# EAGLE design RN4020_Breakout (EAGLE 8.2.2)
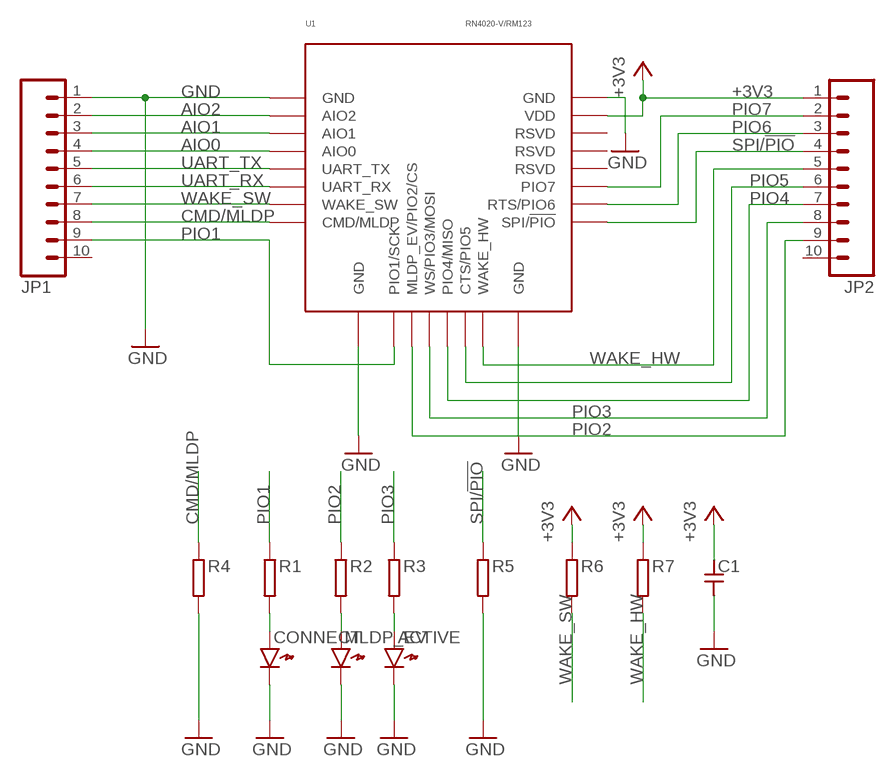
[diagram p0: schematic, sheet 1]

## Parts
ACTIVE  LED1608_REDUCED  [LED1608_REDUCED]
C1  CAPACITOR1608_REDUCED  [SMD1608_REDUCED]
CONNECT  LED1608_REDUCED  [LED1608_REDUCED]
JP1  M10NOSILK  [1X10-NOSILK]
JP2  M10NOSILK  [1X10-NOSILK]
MLDP_EV  LED1608_REDUCED  [LED1608_REDUCED]
R1  RESISTOR1608_REDUCED  [SMD1608_REDUCED]
R2  RESISTOR1608_REDUCED  [SMD1608_REDUCED]
R3  RESISTOR1608_REDUCED  [SMD1608_REDUCED]
R4  RESISTOR1608_REDUCED  [SMD1608_REDUCED]
R5  RESISTOR1608_REDUCED  [SMD1608_REDUCED]
R6  RESISTOR1608_REDUCED  [SMD1608_REDUCED]
R7  RESISTOR1608_REDUCED  [SMD1608_REDUCED]
U1  RN4020-V/RM123  [RN4020]

## Nets
+3V3: C1.1 JP2.1 R6.1 R7.1 U1.23(VDD)
AIO0: JP1.4 U1.4(AIO0)
AIO1: JP1.3 U1.3(AIO1)
AIO2: JP1.2 U1.2(AIO2)
CMD/MLDP: JP1.8 R4.1 U1.8(CMD/MLDP)
GND: ACTIVE.K C1.2 CONNECT.K JP1.1 MLDP_EV.K R4.2 R5.2 U1.1(GND) U1.9(GND) U1.16(GND) U1.24(GND)
N$5: CONNECT.A R1.2
N$6: MLDP_EV.A R2.2
N$7: ACTIVE.A R3.2
PIO1: JP1.9 R1.1 U1.10(PIO1/SCK)
PIO2: JP2.9 R2.1 U1.11(MLDP_EV/PIO2/CS)
PIO3: JP2.8 R3.1 U1.12(WS/PIO3/MOSI)
PIO4: JP2.7 U1.13(PIO4/MISO)
PIO5: JP2.6 U1.14(CTS/PIO5)
PIO6: JP2.3 U1.18(RTS/PIO6)
PIO7: JP2.2 U1.19(PIO7)
SPI/!PIO: JP2.4 R5.1 U1.17(SPI/!PIO)
UART_RX: JP1.6 U1.6(UART_RX)
UART_TX: JP1.5 U1.5(UART_TX)
WAKE_HW: JP2.5 R7.2 U1.15(WAKE_HW)
WAKE_SW: JP1.7 R6.2 U1.7(WAKE_SW)
Unconnected: JP1.10 JP2.10 U1.20(RSVD) U1.21(RSVD) U1.22(RSVD)

## Library data of the parts
ACTIVE CONNECT MLDP_EV = generic:LED: Generic LEDs
C1 = generic:CAPACITOR: Generic Capacitor
JP1 JP2 = header:M10
R1-R7 = generic:RESISTOR: Generic Registor
U1 = com_module:RN4020: Bluetooth Low Energy Module Microchip

## Board
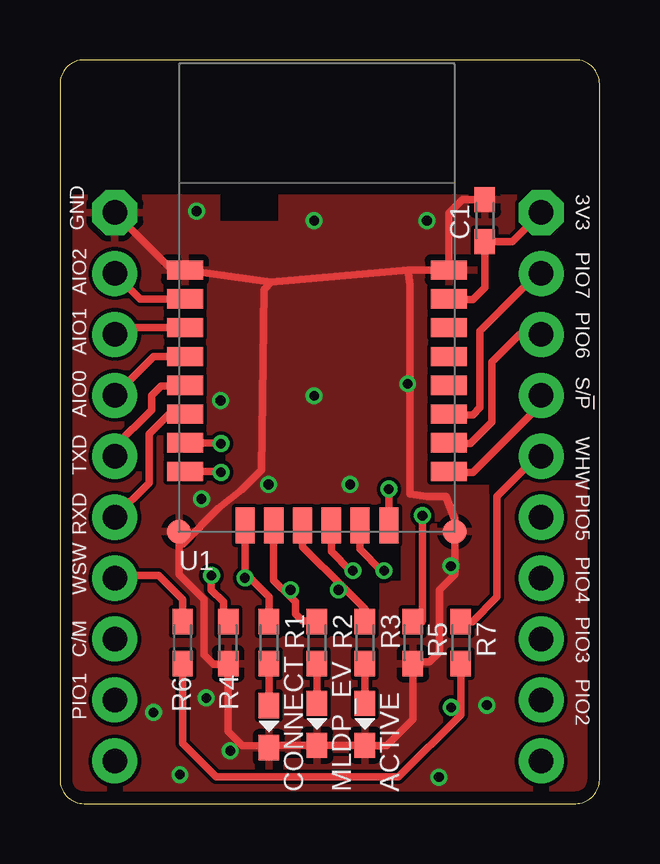
[diagram p1: board, top side]
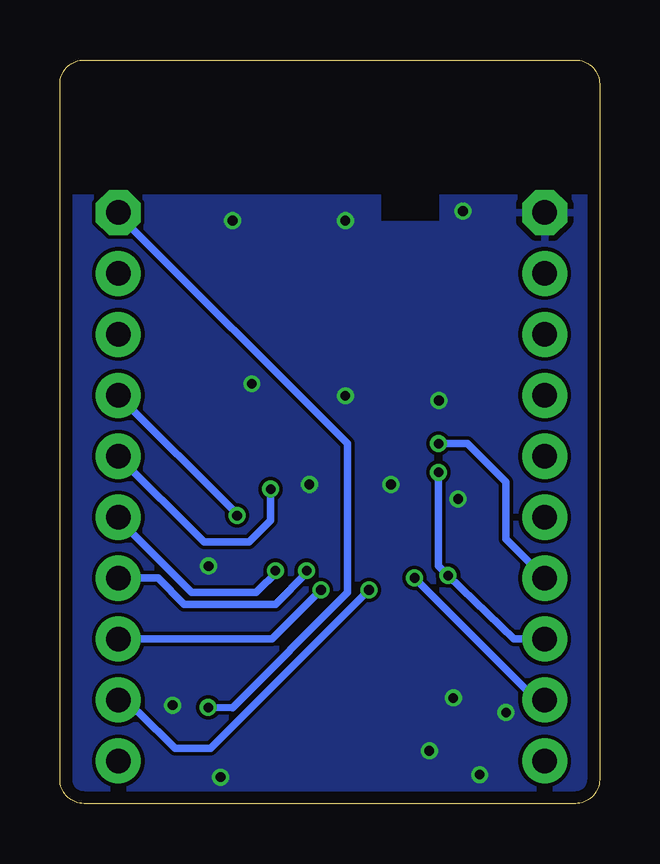
[diagram p2: board, bottom side, seen from below]

Size 22.5 x 31 mm. Coordinates in mm from the lower left corner, seen from the top.
Outline: 0,30 0,1 arc90 1,0 21.5,0 arc90 22.5,1 22.5,30 arc90 21.5,31 1,31 arc90 0,30
Copper layers (1*16): Top 0.035mm / dielectric 1.6mm / Bottom 0.035mm
Design rules "Elecrow_2-layer_PCB_eagle_rule": minimum track width 6mil, minimum drill 12mil, track to track 6mil, track to pad 6mil, pad to pad 6mil, via to via 8mil, smd to smd 0mil, copper to edge 20mil, drill to drill 10mil, minimum pad ring 6mil, minimum via ring 6mil, stop-mask expansion 0mil, vias tented up to drill 100mil, thermal gap 10mil
tRestrict: area 0,25.4 to 22.5,30.5; area 6.7,24.3 to 9.1,25.9; area 20.6,13.5 to 22.3,13.6; area 17.1,13.3 to 18.3,13.4; area 17.9,12.9 to 18,13.3; area 9.3,1.9 to 10.1,2.1; area 11.5,2 to 12,2.1; area 11.3,7 to 12.2,7.1; area 9.2,7 to 10.2,7.1; area 13.2,8.1 to 13.3,9.3; area 13.9,9.3 to 14.2,10.8
bRestrict: area 0.1,25.4 to 22.5,30.5; area 6.7,24.3 to 9.1,25.9

### Footprints (pad centres in the part's own frame; a part is rotated, then mirrored left to right if it is on the bottom)
LED1608_REDUCED = smd 1.05 x 0.85: A -0.875,0; K 0.875,0
SMD1608_REDUCED = smd 1.05 x 0.85: 1 -0.875,0; 2 0.875,0
1X10-NOSILK = drill 1.016 pad 1.88 octagon: 1 0,0 | drill 1.016 pad 1.88: 2 2.54,0; 3 5.08,0; 4 7.62,0; 5 10.16,0; 6 12.7,0; 7 15.24,0; 8 17.78,0; 9 20.32,0; 10 22.86,0
RN4020 = smd 1.5 x 0.8: 1 0.25,10.9; 2 0.25,9.7; 3 0.25,8.5; 4 0.25,7.3; 5 0.25,6.1; 6 0.25,4.9; 7 0.25,3.7; 8 0.25,2.5; 17 11.25,2.5; 18 11.25,3.7; 19 11.25,4.9; 20 11.25,6.1; 21 11.25,7.3; 22 11.25,8.5; 23 11.25,9.7; 24 11.25,10.9 | smd 1 x 1: 9 0,0; 16 11.5,0 | smd 0.8 x 1.5: 10 2.75,0.25; 11 3.95,0.25; 12 5.15,0.25; 13 6.35,0.25; 14 7.55,0.25; 15 8.75,0.25

### Placement (x,y rotation side)
ACTIVE  12.72,3.31 270 top
C1  17.72,24.31 90 top
CONNECT  8.72,3.21 270 top
JP1  2.29,24.64 270 top
JP2  20.07,24.64 270 top
MLDP_EV  10.72,3.31 270 top
R1  8.72,6.71 270 top
R2  10.72,6.71 270 top
R3  12.72,6.71 270 top
R4  7.02,6.71 270 top
R5  14.72,6.71 270 top
R6  5.12,6.71 90 top
R7  16.72,6.71 90 top
U1  4.97,11.34 0 top

### Tracks (layer width: path | path; a pad name or v marks a point on that pad's centre or on a via)
+3V3  (via drill 0.4)
  Top 0.305: 16.72,3.93 R7.1 | 16.72,3.93 16.72,3.71 14.12,1.11 6.52,1.11 5.12,2.51 R6.1 | JP2.1 18.86,23.43 C1.1 17.72,21.51 17.22,21.01 16.25,21.01 U1.23 | v16.32,4.01 16.64,4.01 16.72,3.93
  Bottom 0.305: JP2.1 20.07,24.56 10.52,15.01 10.52,8.81 15.3,4 v16.32,4.01
AIO0
  Top 0.305: U1.4 3.91,18.64 JP1.4
AIO1
  Top 0.305: U1.3 2.57,19.84 JP1.3
AIO2
  Top 0.305: U1.2 3.35,21.04 JP1.2
CMD/MLDP  (via drill 0.4)
  Top 0.305: R4.1 6.82,7.78 6.82,8.41 6.31,8.91 v6.32,9.51 | U1.8 6.69,13.84 v6.72,13.81
  Bottom 0.305: JP1.8 3.57,6.86 v6.32,9.51 6.72,9.91 v6.72,13.81
GND  (via drill 0.4)
  Top 0.305: JP1.1 4.69,22.24 U1.1 8.79,21.73 | C1.2 16.79,25.18 16.22,24.61 U1.24 14.5,22.24 | 8.79,21.73 14.5,22.24 | 14.72,5.78 R5.2 | 14.72,5.78 14.72,3.51 13.62,2.41 12.74,2.41 ACTIVE.K MLDP_EV.K 8.82,2.43 CONNECT.K 8.64,2.41 7.62,2.41 7.02,3.01 R4.2 6.99,5.81 6.42,5.81 6.02,6.21 6.02,8.51 4.97,9.56 U1.9 5.13,10.83 6.6,12.3 7.6,13.1 8.4,13.9 8.5,21.44 8.79,21.73 | 14.72,5.78 14.85,5.91 15.42,5.91 15.82,6.31 15.82,8.91 16.47,9.56 U1.16 16.47,11.83 16.1,12.8 15.3,12.8 14.6,12.9 14.6,21.63 14.5,22.24
  other vias: 5,1.2 7.1,2.2 3.9,3.8 6.1,4.4 15.8,1.1 17.8,4.1 16.3,9.9 12.1,13.3 8.7,13.3 5.9,12.7 6.7,16.8 10.6,17 14.5,17.5 15.3,24.3 10.6,24.3 5.7,24.7
  pour Top: 0,30.5 22.5,30.5 22.5,0 0,0
  pour Bottom: 0,30.5 22.5,30.5 22.5,0 0,0
N$5
  Top 0.305: R1.2 CONNECT.A
N$6
  Top 0.305: R2.2 MLDP_EV.A
N$7
  Top 0.305: R3.2 ACTIVE.A
PIO1  (via drill 0.4)
  Top 0.305: 7.72,9.61 U1.10 | 7.72,9.61 8.72,8.61 R1.1 | v7.72,9.41 7.72,9.61
  Bottom 0.305: JP1.9 2.83,4.52 v7.72,9.41
PIO2  (via drill 0.4)
  Top 0.305: U1.11 8.92,9.31 9.62,8.61 | R2.1 10.69,7.61 10.12,7.61 9.82,7.91 9.82,8.41 9.62,8.61 | v9.62,8.91 9.62,8.61
  Bottom 0.305: JP2.9 19.21,3.81 17.7,2.3 16.22,2.3 v9.62,8.91
PIO3  (via drill 0.4)
  Top 0.305: U1.12 10.12,10.71 11.83,8.99 | 11.83,8.99 12.72,8.11 12.69,7.61 R3.1 | v11.62,8.91 11.75,8.91 11.83,8.99
  Bottom 0.305: JP2.8 13.67,6.86 v11.62,8.91
PIO4  (via drill 0.4)
  Top 0.305: v12.22,9.71 12.12,9.71 11.32,10.51 U1.13
  Bottom 0.305: JP2.7 18.41,9.4 17.32,8.31 13.52,8.31 12.22,9.61 v12.22,9.71
PIO5  (via drill 0.4)
  Top 0.305: v13.52,9.71 13.42,9.71 12.52,10.61 U1.14
  Bottom 0.305: JP2.6 20.15,11.94 17.02,8.81 14.32,8.81 13.42,9.71 v13.52,9.71
PIO6
  Top 0.305: JP2.3 19.17,19.56 18.02,18.41 18.02,15.91 17.12,15.01 16.25,15.01 U1.18
PIO7
  Top 0.305: JP2.2 19.91,22.1 17.52,19.71 17.52,16.51 17.22,16.21 16.25,16.21 U1.19
SPI/!PIO  (via drill 0.4)
  Top 0.305: JP2.4 20.07,16.66 17.22,13.81 16.25,13.81 U1.17 | R5.1 15.09,7.58 15.12,7.61 v15.12,12.01
  Bottom 0.305: v15.12,12.01 15.12,12.07 JP2.4
UART_RX
  Top 0.305: U1.6 4.55,16.24 3.72,15.41 3.72,13.37 JP1.6
UART_TX
  Top 0.305: JP1.5 2.29,14.88 3.82,16.41 3.82,17.01 4.22,17.41 5.19,17.41 U1.5
WAKE_HW  (via drill 0.4)
  Top 0.305: JP2.5 19.89,14.48 18.22,12.81 18.22,8.61 17.19,7.58 R7.2 | U1.15 v13.72,13.11
  Bottom 0.305: v13.72,13.11 13.72,11.81 14.62,10.91 16.5,10.91 JP2.5
WAKE_SW  (via drill 0.4)
  Top 0.305: U1.7 6.79,15.04 6.82,15.01 v6.72,15.01 | R6.2 5.12,8.51 4.12,9.51 2.4,9.51 JP1.7
  Bottom 0.305: v6.72,15.01 5.52,15.01 3.92,13.41 3.92,11.03 JP1.7

### Text on the board
tPlace: 3V3 | GND | PIO7 | AIO2 | PIO6 | AIO1 | S/!P | AIO0 | WHW | TXD | PIO5 | RXD | PIO4 | WSW | PIO3 | C/M | PIO2 | PIO1